# Altium schematic sheet LibreSolar_BMS48V_0.SchDoc: LibreSolar_BMS48V
size 410 x 286 mm; Date: 2018-10-18 5:55:51 PM; SheetNumber: 1; GateName_1: G$1; SymbolName_1: DINA3_L; LibraryName: frames; DeviceSetName: DINA3_L; GateName_2: G$2; SymbolName_2: DOCFIELD
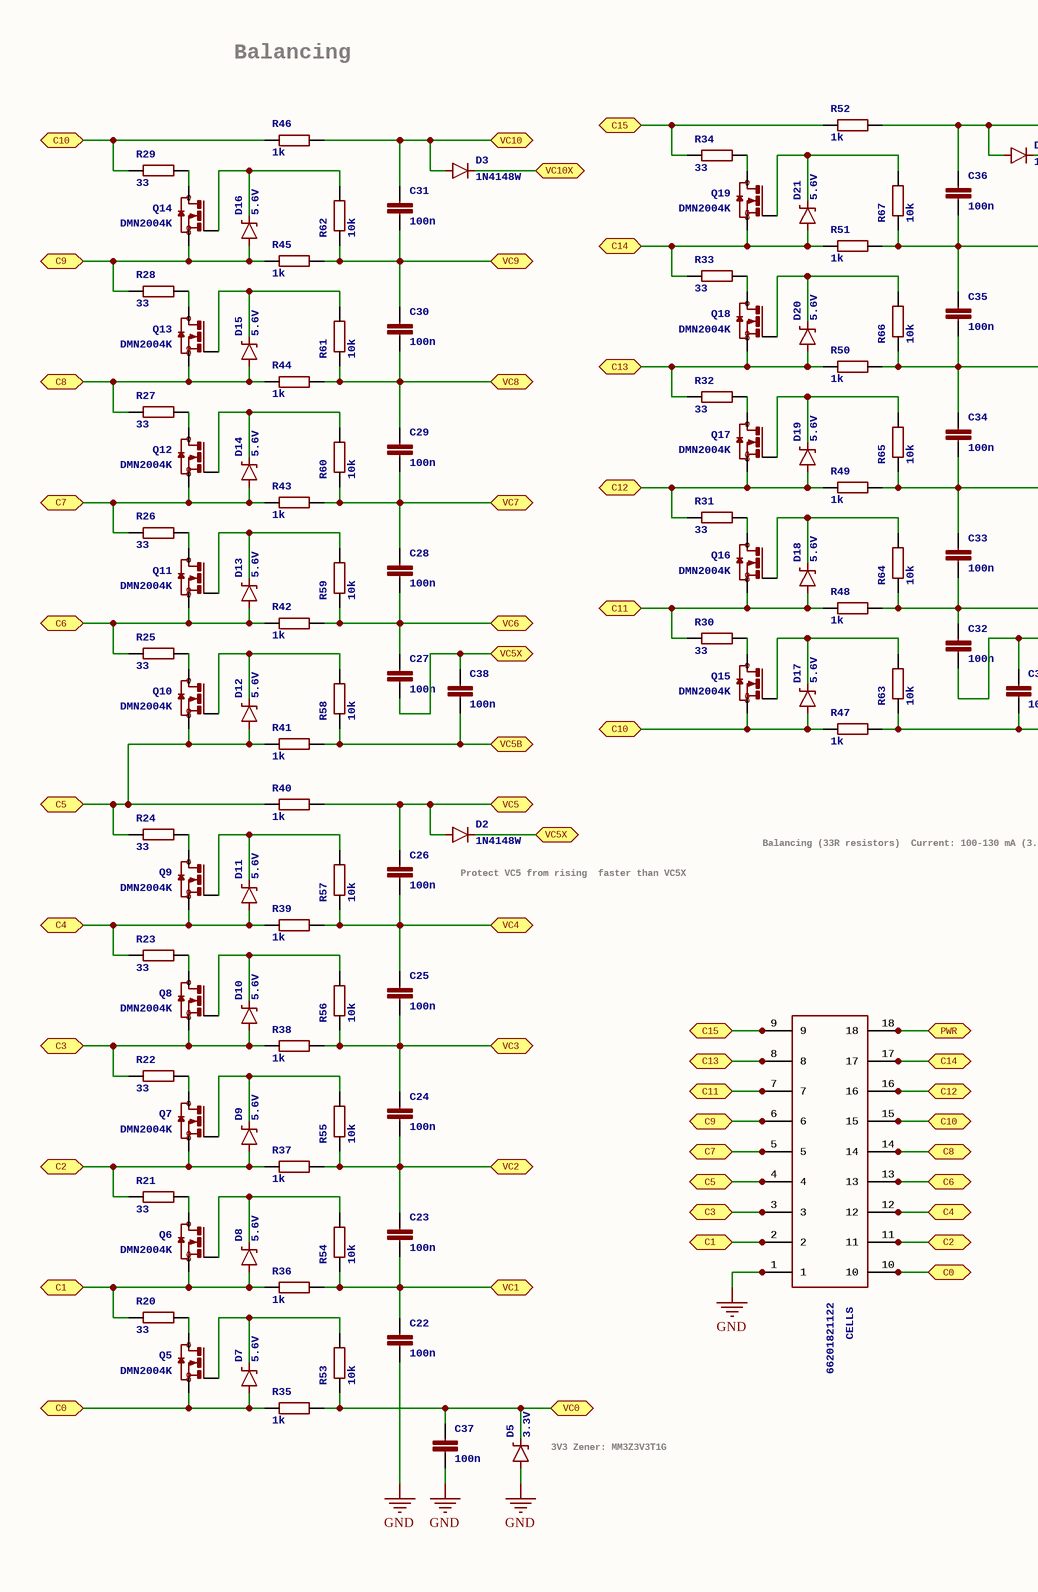
[diagram p0: LibreSolar_BMS48V_0.SchDoc, left]
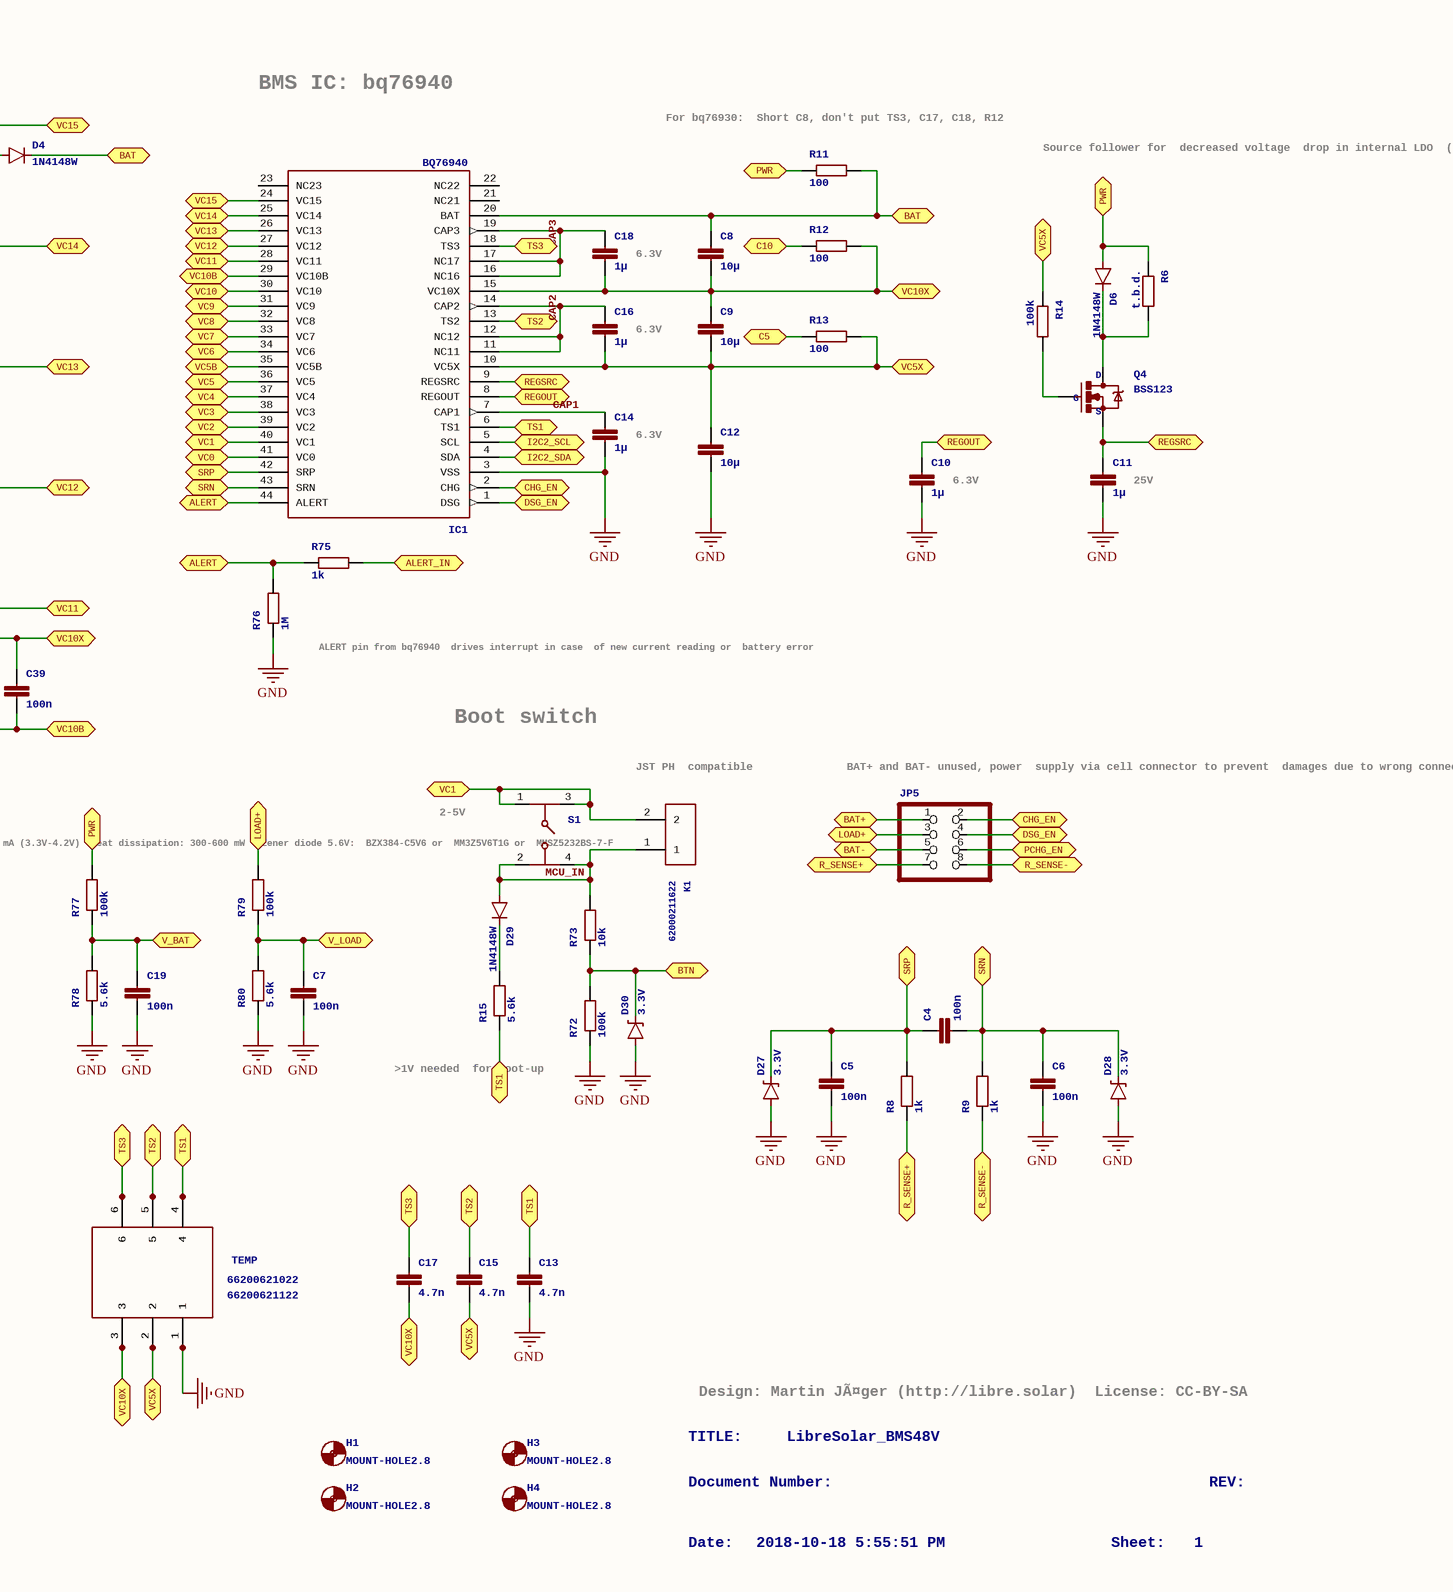
[diagram p1: LibreSolar_BMS48V_0.SchDoc, right]

## Parts
C4  100n  [C0603]
C5  100n  [C0603]
C6  100n  [C0603]
C7  100n  [C0603]
C8  10µ  [C1210]
C9  10µ  [C1210]
C10  1µ  [C0603]
C11  1µ  [C0603]
C12  10µ  [C1210]
C13  4.7n  [C0603]
C14  1µ  [C0603]
C15  4.7n  [C0603]
C16  1µ  [C0603]
C17  4.7n  [C0603]
C18  1µ  [C0603]
C19  100n  [C0603]
C22  100n  [C0603]
C23  100n  [C0603]
C24  100n  [C0603]
C25  100n  [C0603]
C26  100n  [C0603]
C27  100n  [C0603]
C28  100n  [C0603]
C29  100n  [C0603]
C30  100n  [C0603]
C31  100n  [C0603]
C32  100n  [C0603]
C33  100n  [C0603]
C34  100n  [C0603]
C35  100n  [C0603]
C36  100n  [C0603]
C37  100n  [C0603]
C38  100n  [C0603]
C39  100n  [C0603]
CELLS  66201821022  [66201821022]  (value not drawn)
D2  1N4148W  [SOD-123]
D3  1N4148W  [SOD-123]
D4  1N4148W  [SOD-123]
D5  3.3V  [SOD-323]
D6  1N4148W  [SOD-123]
D7  5.6V  [SOD-323]
D8  5.6V  [SOD-323]
D9  5.6V  [SOD-323]
D10  5.6V  [SOD-323]
D11  5.6V  [SOD-323]
D12  5.6V  [SOD-323]
D13  5.6V  [SOD-323]
D14  5.6V  [SOD-323]
D15  5.6V  [SOD-323]
D16  5.6V  [SOD-323]
D17  5.6V  [SOD-323]
D18  5.6V  [SOD-323]
D19  5.6V  [SOD-323]
D20  5.6V  [SOD-323]
D21  5.6V  [SOD-323]
D27  3.3V  [SOD-323]
D28  3.3V  [SOD-323]
D29  1N4148W  [SOD-123]
D30  3.3V  [SOD-323]
H1  MOUNT-HOLE2.8  [2,8]
H2  MOUNT-HOLE2.8  [2,8]
H3  MOUNT-HOLE2.8  [2,8]
H4  MOUNT-HOLE2.8  [2,8]
IC1  BQ76940  [TSSOP44]
JP5  PINHD-2X4  [2X04]  (value not drawn)
K1  62000211622  [62000211622]
K4  66200621122  [66200621122]
K5  66201821122  [66201821122]
Q4  BSS123  [SOT23-3]
Q5  DMN2004K  [SOT23]
Q6  DMN2004K  [SOT23]
Q7  DMN2004K  [SOT23]
Q8  DMN2004K  [SOT23]
Q9  DMN2004K  [SOT23]
Q10  DMN2004K  [SOT23]
Q11  DMN2004K  [SOT23]
Q12  DMN2004K  [SOT23]
Q13  DMN2004K  [SOT23]
Q14  DMN2004K  [SOT23]
Q15  DMN2004K  [SOT23]
Q16  DMN2004K  [SOT23]
Q17  DMN2004K  [SOT23]
Q18  DMN2004K  [SOT23]
Q19  DMN2004K  [SOT23]
R6  t.b.d.  [R0603]
R8  1k  [R0603]
R9  1k  [R0603]
R11  100  [R0603]
R12  100  [R0603]
R13  100  [R0603]
R14  100k  [R0603]
R15  5.6k  [R0603]
R20  33  [R2010]
R21  33  [R2010]
R22  33  [R2010]
R23  33  [R2010]
R24  33  [R2010]
R25  33  [R2010]
R26  33  [R2010]
R27  33  [R2010]
R28  33  [R2010]
R29  33  [R2010]
R30  33  [R2010]
R31  33  [R2010]
R32  33  [R2010]
R33  33  [R2010]
R34  33  [R2010]
R35  1k  [R0603]
R36  1k  [R0603]
R37  1k  [R0603]
R38  1k  [R0603]
R39  1k  [R0603]
R40  1k  [R0603]
R41  1k  [R0603]
R42  1k  [R0603]
R43  1k  [R0603]
R44  1k  [R0603]
R45  1k  [R0603]
R46  1k  [R0603]
R47  1k  [R0603]
R48  1k  [R0603]
R49  1k  [R0603]
R50  1k  [R0603]
R51  1k  [R0603]
R52  1k  [R0603]
R53  10k  [R0603]
R54  10k  [R0603]
R55  10k  [R0603]
R56  10k  [R0603]
R57  10k  [R0603]
R58  10k  [R0603]
R59  10k  [R0603]
R60  10k  [R0603]
R61  10k  [R0603]
R62  10k  [R0603]
R63  10k  [R0603]
R64  10k  [R0603]
R65  10k  [R0603]
R66  10k  [R0603]
R67  10k  [R0603]
R72  100k  [R0603]
R73  10k  [R0603]
R75  1k  [R0603]
R76  1M  [R0603]
R77  100k  [R0603]
R78  5.6k  [R0603]
R79  100k  [R0603]
R80  5.6k  [R0603]
S1  430182050816  [430182050816]  (value not drawn)
TEMP  66200621022  [66200621022]

## Ports
ALERT, ALERT_IN, BAT, BAT+, BAT-, BTN, C0, C1, C2, C3, C4, C5, C6, C7, C8, C9, C10, C11, C12, C13, C14, C15, CHG_EN, DSG_EN, I2C2_SCL, I2C2_SDA, LOAD+, PCHG_EN, PWR, R_SENSE+, R_SENSE-, REGOUT, REGSRC, SRN, SRP, TS1, TS2, TS3, V_BAT, V_LOAD, VC0, VC1, VC2, VC3, VC4, VC5, VC5B, VC5X, VC6, VC7, VC8, VC9, VC10, VC10B, VC10X, VC11, VC12, VC13, VC14, VC15

## Nets
GND: C5.2 C6.2 C7.2 C10.2 C11.2 C12.2 C13.2 C14.2 C19.2 C22.2 C37.2 CELLS.1 D5.A D27.A D28.A D30.A IC1.3(VSS) K4.1 K5.1 R72.1 R76.1 R78.1 R80.1 TEMP.1
ALERT: IC1.44(ALERT) R75.1 R76.2 ; port ALERT
ALERT_IN: R75.2 ; port ALERT_IN
BAT: C8.1 D4.C IC1.20(BAT) R11.2 ; port BAT
BAT+: JP5.1 ; port BAT+
BAT-: JP5.5 ; port BAT-
BTN: D30.C R72.2 R73.1 ; port BTN
C0: CELLS.10 D7.A K5.10 Q5.2(S) R35.1 ; port C0
C1: CELLS.2 D8.A K5.2 Q6.2(S) R20.1 R36.1 ; port C1
C2: CELLS.11 D9.A K5.11 Q7.2(S) R21.1 R37.1 ; port C2
C3: CELLS.3 D10.A K5.3 Q8.2(S) R22.1 R38.1 ; port C3
C4: CELLS.12 D11.A K5.12 Q9.2(S) R23.1 R39.1 ; port C4
C5: CELLS.4 D12.A K5.4 Q10.2(S) R13.1 R24.1 R40.1 R41.1 ; port C5
C6: CELLS.13 D13.A K5.13 Q11.2(S) R25.1 R42.1 ; port C6
C7: CELLS.5 D14.A K5.5 Q12.2(S) R26.1 R43.1 ; port C7
C8: CELLS.14 D15.A K5.14 Q13.2(S) R27.1 R44.1 ; port C8
C9: CELLS.6 D16.A K5.6 Q14.2(S) R28.1 R45.1 ; port C9
C10: CELLS.15 D17.A K5.15 Q15.2(S) R12.1 R29.1 R46.1 R47.1 ; port C10
C11: CELLS.7 D18.A K5.7 Q16.2(S) R30.1 R48.1 ; port C11
C12: CELLS.16 D19.A K5.16 Q17.2(S) R31.1 R49.1 ; port C12
C13: CELLS.8 D20.A K5.8 Q18.2(S) R32.1 R50.1 ; port C13
C14: CELLS.17 D21.A K5.17 Q19.2(S) R33.1 R51.1 ; port C14
C15: CELLS.9 K5.9 R34.1 R52.1 ; port C15
CAP1: C14.1 IC1.7(CAP1)
CAP2: C16.1 IC1.11(NC11) IC1.12(NC12) IC1.14(CAP2)
CAP3: C18.1 IC1.16(NC16) IC1.17(NC17) IC1.19(CAP3)
CHG_EN: IC1.2(CHG) JP5.2 ; port CHG_EN
DSG_EN: IC1.1(DSG) JP5.4 ; port DSG_EN
I2C2_SCL: IC1.5(SCL) ; port I2C2_SCL
I2C2_SDA: IC1.4(SDA) ; port I2C2_SDA
LOAD+: JP5.3 R79.2 ; port LOAD+
MCU_IN: D29.A K1.1 R73.2 S1.2 S1.4
PCHG_EN: JP5.6 ; port PCHG_EN
PWR: CELLS.18 D6.A K5.18 R6.1 R11.1 R77.2 ; port PWR
R_SENSE+: JP5.7 R8.1 ; port R_SENSE+
R_SENSE-: JP5.8 R9.1 ; port R_SENSE-
REGOUT: C10.1 IC1.8(REGOUT) ; port REGOUT
REGSRC: C11.1 IC1.9(REGSRC) Q4.2(S) ; port REGSRC
SRN: C4.2 C6.1 D28.C IC1.43(SRN) R9.2 ; port SRN
SRP: C4.1 C5.1 D27.C IC1.42(SRP) R8.2 ; port SRP
TS1: C13.1 IC1.6(TS1) K4.4 R15.1 TEMP.4 ; port TS1
TS2: C15.1 IC1.13(TS2) K4.5 TEMP.5 ; port TS2
TS3: C17.1 IC1.18(TS3) K4.6 TEMP.6 ; port TS3
V_BAT: C19.1 R77.1 R78.2 ; port V_BAT
V_LOAD: C7.1 R79.1 R80.2 ; port V_LOAD
VC0: C37.1 D5.C IC1.41(VC0) R35.2 R53.1 ; port VC0
VC1: C22.1 C23.2 IC1.40(VC1) K1.2 R36.2 R54.1 S1.1 S1.3 ; port VC1
VC2: C23.1 C24.2 IC1.39(VC2) R37.2 R55.1 ; port VC2
VC3: C24.1 C25.2 IC1.38(VC3) R38.2 R56.1 ; port VC3
VC4: C25.1 C26.2 IC1.37(VC4) R39.2 R57.1 ; port VC4
VC5: C26.1 D2.A IC1.36(VC5) R40.2 ; port VC5
VC5B: C38.2 IC1.35(VC5B) R41.2 R58.1 ; port VC5B
VC5X: C9.2 C12.1 C15.2 C16.2 C27.2 C38.1 D2.C IC1.10(VC5X) K4.2 R13.2 R14.1 TEMP.2 ; port VC5X
VC6: C27.1 C28.2 IC1.34(VC6) R42.2 R59.1 ; port VC6
VC7: C28.1 C29.2 IC1.33(VC7) R43.2 R60.1 ; port VC7
VC8: C29.1 C30.2 IC1.32(VC8) R44.2 R61.1 ; port VC8
VC9: C30.1 C31.2 IC1.31(VC9) R45.2 R62.1 ; port VC9
VC10: C31.1 D3.A IC1.30(VC10) R46.2 ; port VC10
VC10B: C39.2 IC1.29(VC10B) R47.2 R63.1 ; port VC10B
VC10X: C8.2 C9.1 C17.2 C18.2 C32.2 C39.1 D3.C IC1.15(VC10X) K4.3 R12.2 TEMP.3 ; port VC10X
VC11: C32.1 C33.2 IC1.28(VC11) R48.2 R64.1 ; port VC11
VC12: C33.1 C34.2 IC1.27(VC12) R49.2 R65.1 ; port VC12
VC13: C34.1 C35.2 IC1.26(VC13) R50.2 R66.1 ; port VC13
VC14: C35.1 C36.2 IC1.25(VC14) R51.2 R67.1 ; port VC14
VC15: C36.1 D4.A IC1.24(VC15) R52.2 ; port VC15
NetD6_C: D6.C Q4.3(D) R6.2
NetD7_C: D7.C Q5.1(G) R53.2
NetD8_C: D8.C Q6.1(G) R54.2
NetD9_C: D9.C Q7.1(G) R55.2
NetD10_C: D10.C Q8.1(G) R56.2
NetD11_C: D11.C Q9.1(G) R57.2
NetD12_C: D12.C Q10.1(G) R58.2
NetD13_C: D13.C Q11.1(G) R59.2
NetD14_C: D14.C Q12.1(G) R60.2
NetD15_C: D15.C Q13.1(G) R61.2
NetD16_C: D16.C Q14.1(G) R62.2
NetD17_C: D17.C Q15.1(G) R63.2
NetD18_C: D18.C Q16.1(G) R64.2
NetD19_C: D19.C Q17.1(G) R65.2
NetD20_C: D20.C Q18.1(G) R66.2
NetD21_C: D21.C Q19.1(G) R67.2
NetD29_C: D29.C R15.2
NetQ4_1: Q4.1(G) R14.2
NetQ5_3: Q5.3(D) R20.2
NetQ6_3: Q6.3(D) R21.2
NetQ7_3: Q7.3(D) R22.2
NetQ8_3: Q8.3(D) R23.2
NetQ9_3: Q9.3(D) R24.2
NetQ10_3: Q10.3(D) R25.2
NetQ11_3: Q11.3(D) R26.2
NetQ12_3: Q12.3(D) R27.2
NetQ13_3: Q13.3(D) R28.2
NetQ14_3: Q14.3(D) R29.2
NetQ15_3: Q15.3(D) R30.2
NetQ16_3: Q16.3(D) R31.2
NetQ17_3: Q17.3(D) R32.2
NetQ18_3: Q18.3(D) R33.2
NetQ19_3: Q19.3(D) R34.2

Not connected (* = marked no-connect by the designer): IC1 21(NC21) 22(NC22) 23(NC23)

## Notes on the sheet
- Balancing
- BMS IC: bq76940
- (near R11) For bq76930:
  Short C8, don't put TS3, C17, C18, R12
- Source follower for
  decreased voltage
  drop in internal LDO
  (100V N-MOS)
- (near C18) 6.3V
- (near C16) 6.3V
- (near C14) 6.3V
- (near C10) 6.3V
- (near C11) 25V
- (near R76) ALERT pin from bq76940
  drives interrupt in case
  of new current reading or
  battery error
- Boot switch
- 2-5V
- (near K1) JST PH
  compatible
- (near JP5) BAT+ and BAT- unused, power
  supply via cell connector to prevent
  damages due to wrong connection order
- (near D2) Protect VC5 from rising
  faster than VC5X
- (near S1) Balancing (33R resistors)
  Current: 100-130 mA (3.3V-4.2V)
  Heat dissipation: 300-600 mW
  Zener diode 5.6V:
  BZX384-C5V6 or
  MM3Z5V6T1G or
  MMSZ5232BS-7-F
- >1V needed
  for boot-up
- Design: Martin JÃ¤ger (http://libre.solar)
  License: CC-BY-SA
- (near D5) 3V3 Zener: MM3Z3V3T1G
- TITLE:
- Document Number:
- LibreSolar_BMS48V
- REV:
- Date:
- 2018-10-18 5:55:51 PM
- Sheet:
- 1

## Library data of the parts
C4-C7 C13 C15 C17 C19 C22-C39 = C-EUC0603: CAPACITOR, European symbol; MPN: 0603B104K500CT; GateName_1: G$1; SymbolName_1: C-EU; MF: WALSIN; DeviceName: C0603; LibraryName: rcl; DeviceSetName: C-EU; OC_FARNELL: 2496834
C8 C9 C12 = C-EUC1210: CAPACITOR, European symbol; MPN: GRM32ER7YA106KA12L; GateName_1: G$1; SymbolName_1: C-EU; MF: MURATA; DeviceName: C1210; LibraryName: rcl; DeviceSetName: C-EU; OC_FARNELL: 1735537
C10 = C-EUC0603: CAPACITOR, European symbol; MPN: 0805YC475KAT2A; GateName_1: G$1; SymbolName_1: C-EU; MF: AVX; DeviceName: C0603; LibraryName: rcl; DeviceSetName: C-EU; OC_FARNELL: 1657937
C11 C14 C16 C18 = C-EUC0603: CAPACITOR, European symbol; MPN: GRM188R71E105KA12D; GateName_1: G$1; SymbolName_1: C-EU; MF: MURATA; DeviceName: C0603; LibraryName: rcl; DeviceSetName: C-EU; OC_FARNELL: 1735540
CELLS = 66201821022: WR-MPC3 3.00mm Male Dual Row Angled Header with Plastic Pegs, 18 Pins=>Code : Con_WTB-MPC3_2_PCB_THT66201821022  Details see: http://katalog.we-online.de/en/em/662_0xx_210_22Created 2014-06-06, Karrer Zheng2014 (C) WÃ¼rth Elektronik; GateName_1: G$1; SymbolName_1: 9X9; LibraryName: Wire_to_Board_Connectors_rev15d; DeviceSetName: 66201821022
D2-D4 D6 D29 = DIODESOD123: DiodeThese are standard reverse protection diodes and small signal diodes. SMA package can handle up to about 1A. SOD-323 can handle about 200mA. What the SOD-323 package when ordering, there are some mfgs out there that are 5-pin packages.; MPN: 1N4148W-7-F.; GateName_1: G$1; SymbolName_1: DIODE; DeviceName: SOD123; MF: DIODES INC.; LibraryName: SparkFun-DiscreteSemi; DeviceSetName: DIODE; OC_FARNELL: 1776392
D5 D27 D28 D30 = DIODE-ZENER5.6V: Zener Diode Production Part - 8199 3.4V Zener Voltage; MPN: BZX384-C5V6; GateName_1: G$1; DeviceName: 5.6V; MF: NXP; PROD_ID: DIO-12442; SymbolName_1: DIODE-ZENER; LibraryName: SparkFun-DiscreteSemi; DeviceSetName: DIODE-ZENER; OC_FARNELL: 8735743
D7-D21 = DIODE-ZENER5.6V: Zener Diode Production Part - 8199 3.4V Zener Voltage; MPN: BZX384-C5V6; GateName_1: G$1; MF: NXP; PROD_ID: DIO-12442; SymbolName_1: DIODE-ZENER; DeviceName: 5.6V; LibraryName: SparkFun-DiscreteSemi; DeviceSetName: DIODE-ZENER; OC_FARNELL: 8735743
H1-H4 = MOUNT-HOLE2.8: MOUNTING HOLE with drill center marker; GateName_1: G$1; DeviceName: 2.8; SymbolName_1: MOUNT-HOLE; LibraryName: holes; DeviceSetName: MOUNT-HOLE; MF: *; MPN: *; OC_FARNELL: unknown
IC1 = BQ76940: MPN: BQ7694003DBT; GateName_1: G$1; MF: TEXAS INSTRUMENTS; SymbolName_1: BQ76940; LibraryName: LibreSolar; DeviceSetName: BQ76940; OC_FARNELL: 2425791
JP5 = PINHD-2X4: PIN HEADER; GateName_1: A; SymbolName_1: PINH2X4; LibraryName: pinhead; DeviceSetName: PINHD-2X4
K1 = 62000211622: WR-WTB 2.00mm Male Vertical Shrouded Header, 2 Pins=>Code : Con_WTB_2.00_PCB_THT_62000211622  Details see: http://katalog.we-online.de/en/em/620_0xx_116_22Created 2014-06-05, Karrer Zheng2014 (C) WÃ¼rth Elektronik; GateName_1: G$1; SymbolName_1: 2; LibraryName: Wire_to_Board_Connectors_rev15d; DeviceSetName: 62000211622
K4 = 66200621122: WR-MPC3 3.00mm Male Dual Row Vertical Header, 6 Pins=>Code : Con_WTB_MPC3_2_PCB_THT_66200621122  Details see: http://katalog.we-online.de/en/em/662_0xx_211_22Created 2014-06-06, Karrer Zheng2014 (C) WÃ¼rth Elektronik; GateName_1: G$1; SymbolName_1: 3X3-1; LibraryName: Wire_to_Board_Connectors_rev15d; DeviceSetName: 66200621122
K5 = 66201821122: WR-MPC3 3.00mm Male Dual Row Vertical Header, 18 Pins=>Code : Con_WTB_MPC3_2_PCB_THT_66201821122  Details see: http://katalog.we-online.de/en/em/662_0xx_211_22Created 2014-06-06, Karrer Zheng2014 (C) WÃ¼rth Elektronik; GateName_1: G$1; SymbolName_1: 9X9; LibraryName: Wire_to_Board_Connectors_rev15d; DeviceSetName: 66201821122
Q4 = MOSFET-NCHANNELBSS138: Common NMOSFET PartsMFG P/NStore IDProd IDFDD8780TRANS-09984SI7820DNTRANS-11055FDS6630AIC-080892N7002PWTRANS-11151FQP30N06L  COM-10213TRANS-10060BSS123LT1GTRANS-08345BSS138TRANS-00830BS1702N7000; MPN: 2N7002,215; GateName_1: G$1; SymbolName_1: MOSFET-NCHANNEL-1; DeviceName: BSS138; MF: NXP; LibraryName: SparkFun-DiscreteSemi; DeviceSetName: MOSFET-NCHANNEL; OC_FARNELL: 1510761; PROD_ID: TRANS-00830; D: D; S: S; G: G
Q5-Q19 = DMN2004K: N-CHANNEL MOS FET with low VGS and ESD protection; MPN: DMN2004K-7; GateName_1: G$1; SymbolName_1: N-MOS; MF: DIODES INC.; LibraryName: resolut; DeviceSetName: DMN2004K; OC_FARNELL: 1713842
R6 R8 R9 R11-R13 R15 R35-R52 R72 R73 R75 R77-R80 = R-EU_R0603: RESISTOR, European symbol; MPN: MCMR06X1001FTL; GateName_1: G$1; SymbolName_1: R-EU; DeviceSetName: R-EU_; MF: MULTICOMP; DeviceName: R0603; LibraryName: rcl; OC_FARNELL: 2073348
R14 = R-EU_R0603: RESISTOR, European symbol; GateName_1: G$1; SymbolName_1: R-EU; DeviceSetName: R-EU_; DeviceName: R0603; LibraryName: rcl; MF: *; MPN: *; OC_FARNELL: unknown
R20-R34 = R-EU_R2010: RESISTOR, European symbol; MPN: ASC2010-33RFT4; GateName_1: G$1; SymbolName_1: R-EU; DeviceSetName: R-EU_; MF: WELWYN; DeviceName: R2010; LibraryName: rcl; OC_FARNELL: 2079038
R53-R67 = R-EU_R0603: RESISTOR, European symbol; MPN: ERJ3EKF1002V; GateName_1: G$1; SymbolName_1: R-EU; DeviceSetName: R-EU_; MF: PANASONIC ELECTRONIC COMPONENTS; DeviceName: R0603; LibraryName: rcl; OC_FARNELL: 2303192
R76 = R-EU_R0603: RESISTOR, European symbol; MPN: ERJU06F1004V; GateName_1: G$1; SymbolName_1: R-EU; DeviceSetName: R-EU_; MF: PANASONIC ELECTRONIC COMPONENTS; DeviceName: R0603; LibraryName: rcl; OC_FARNELL: 2145441
S1 = 430182050816: 6x6 mm SMD WS-TASV Details see: http://katalog.we-online.de/em/datasheet/4301x2xxx8x6.pdf2015 (C) WÃ¼rth Elektronik; GateName_1: G$1; SymbolName_1: TAV; LibraryName: EAGLE-TACT_SWITCHES-rev16e; DeviceSetName: 430182050816
TEMP = 66200621022: WR-MPC3 3.00mm Male Dual Row Angled Header with Plastic Pegs, 6 Pins=>Code : Con_WTB-MPC3_2_PCB_THT66200621022  Details see: http://katalog.we-online.de/en/em/662_0xx_210_22Created 2014-06-06, Karrer Zheng2014 (C) WÃ¼rth Elektronik; GateName_1: G$1; SymbolName_1: 3X3-1; LibraryName: Wire_to_Board_Connectors_rev15d; DeviceSetName: 66200621022